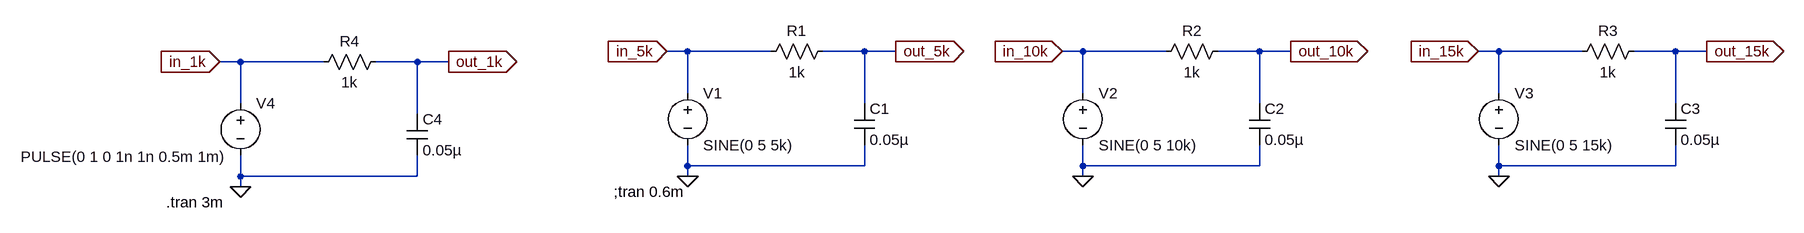
[diagram p0: schematic RC_circuit.asc]
RC_circuit.asc, the LTspice schematic file:
Version 4
SHEET 1 1480 680
WIRE -768 -640 -800 -640
WIRE -640 -640 -768 -640
WIRE -496 -640 -560 -640
WIRE -448 -640 -496 -640
WIRE -160 -640 -192 -640
WIRE -32 -640 -160 -640
WIRE 112 -640 48 -640
WIRE 160 -640 112 -640
WIRE 480 -640 448 -640
WIRE 608 -640 480 -640
WIRE 752 -640 688 -640
WIRE 800 -640 752 -640
WIRE -1456 -624 -1488 -624
WIRE -1328 -624 -1456 -624
WIRE -1184 -624 -1248 -624
WIRE -1136 -624 -1184 -624
WIRE -768 -576 -768 -640
WIRE -160 -576 -160 -640
WIRE 480 -576 480 -640
WIRE -1456 -560 -1456 -624
WIRE -496 -560 -496 -640
WIRE 112 -560 112 -640
WIRE 752 -560 752 -640
WIRE -1184 -544 -1184 -624
WIRE -768 -464 -768 -496
WIRE -496 -464 -496 -496
WIRE -496 -464 -768 -464
WIRE -160 -464 -160 -496
WIRE 112 -464 112 -496
WIRE 112 -464 -160 -464
WIRE 480 -464 480 -496
WIRE 752 -464 752 -496
WIRE 752 -464 480 -464
WIRE -1456 -448 -1456 -480
WIRE -1184 -448 -1184 -480
WIRE -1184 -448 -1456 -448
WIRE -768 -448 -768 -464
WIRE -160 -448 -160 -464
WIRE 480 -448 480 -464
WIRE -1456 -432 -1456 -448
FLAG -768 -448 0
FLAG -800 -640 in_5k
IOPIN -800 -640 In
FLAG -448 -640 out_5k
IOPIN -448 -640 Out
FLAG -160 -448 0
FLAG -192 -640 in_10k
IOPIN -192 -640 In
FLAG 160 -640 out_10k
IOPIN 160 -640 Out
FLAG 480 -448 0
FLAG 448 -640 in_15k
IOPIN 448 -640 In
FLAG 800 -640 out_15k
IOPIN 800 -640 Out
FLAG -1456 -432 0
FLAG -1488 -624 in_1k
IOPIN -1488 -624 In
FLAG -1136 -624 out_1k
IOPIN -1136 -624 Out
SYMBOL voltage -768 -592 R0
WINDOW 123 0 0 Left 2
WINDOW 39 0 0 Left 2
SYMATTR InstName V1
SYMATTR Value SINE(0 5 5k)
SYMBOL res -656 -624 R270
WINDOW 0 32 56 VTop 2
WINDOW 3 0 56 VBottom 2
SYMATTR InstName R1
SYMATTR Value 1k
SYMBOL cap -512 -560 R0
SYMATTR InstName C1
SYMATTR Value 0.05µ
SYMBOL voltage -160 -592 R0
WINDOW 123 0 0 Left 2
WINDOW 39 0 0 Left 2
SYMATTR InstName V2
SYMATTR Value SINE(0 5 10k)
SYMBOL res -48 -624 R270
WINDOW 0 32 56 VTop 2
WINDOW 3 0 56 VBottom 2
SYMATTR InstName R2
SYMATTR Value 1k
SYMBOL cap 96 -560 R0
SYMATTR InstName C2
SYMATTR Value 0.05µ
SYMBOL voltage 480 -592 R0
WINDOW 123 0 0 Left 2
WINDOW 39 0 0 Left 2
SYMATTR InstName V3
SYMATTR Value SINE(0 5 15k)
SYMBOL res 592 -624 R270
WINDOW 0 32 56 VTop 2
WINDOW 3 0 56 VBottom 2
SYMATTR InstName R3
SYMATTR Value 1k
SYMBOL cap 736 -560 R0
SYMATTR InstName C3
SYMATTR Value 0.05µ
SYMBOL voltage -1456 -576 R0
WINDOW 3 -338 98 Left 2
WINDOW 123 0 0 Left 2
WINDOW 39 0 0 Left 2
SYMATTR InstName V4
SYMATTR Value PULSE(0 1 0 1n 1n 0.5m 1m)
SYMBOL res -1344 -608 R270
WINDOW 0 32 56 VTop 2
WINDOW 3 0 56 VBottom 2
SYMATTR InstName R4
SYMATTR Value 1k
SYMBOL cap -1200 -544 R0
SYMATTR InstName C4
SYMATTR Value 0.05µ
TEXT -882 -424 Left 2 !;tran 0.6m
TEXT -1570 -408 Left 2 !.tran 3m

The netlist it stands for:
* RC_circuit.asc
V1 in_5k 0 SINE(0 5 5k)
R1 in_5k out_5k 1k
C1 out_5k 0 0.05µ
V2 in_10k 0 SINE(0 5 10k)
R2 in_10k out_10k 1k
C2 out_10k 0 0.05µ
V3 in_15k 0 SINE(0 5 15k)
R3 in_15k out_15k 1k
C3 out_15k 0 0.05µ
V4 in_1k 0 PULSE(0 1 0 1n 1n 0.5m 1m)
R4 in_1k out_1k 1k
C4 out_1k 0 0.05µ
;tran 0.6m
.tran 3m
.backanno
.end